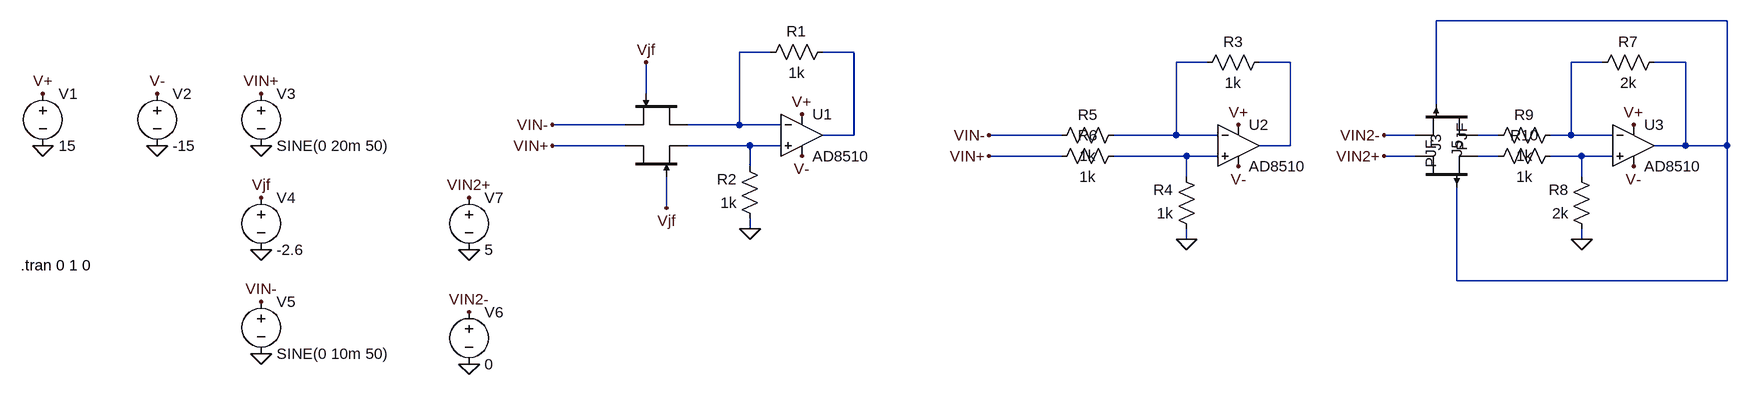
[diagram p0: schematic jfet_gain.asc]
jfet_gain.asc, the LTspice schematic file:
Version 4
SHEET 1 2616 680
WIRE 2608 -160 2160 -160
WIRE 1136 -112 1088 -112
WIRE 1264 -112 1216 -112
WIRE 1808 -96 1760 -96
WIRE 1936 -96 1888 -96
WIRE 2416 -96 2368 -96
WIRE 2544 -96 2496 -96
WIRE 944 -48 944 -96
WIRE 2160 -32 2160 -160
WIRE 912 0 800 0
WIRE 1088 0 1088 -112
WIRE 1088 0 1008 0
WIRE 1152 0 1088 0
WIRE 1264 16 1264 -112
WIRE 1264 16 1216 16
WIRE 1584 16 1472 16
WIRE 1760 16 1760 -96
WIRE 1760 16 1664 16
WIRE 1824 16 1760 16
WIRE 2128 16 2080 16
WIRE 2256 16 2224 16
WIRE 2368 16 2368 -96
WIRE 2368 16 2336 16
WIRE 2432 16 2368 16
WIRE 912 32 800 32
WIRE 1104 32 1008 32
WIRE 1152 32 1104 32
WIRE 1936 32 1936 -96
WIRE 1936 32 1888 32
WIRE 2544 32 2544 -96
WIRE 2544 32 2496 32
WIRE 2608 32 2608 -160
WIRE 2608 32 2544 32
WIRE 1584 48 1472 48
WIRE 1776 48 1664 48
WIRE 1824 48 1776 48
WIRE 2128 48 2080 48
WIRE 2256 48 2224 48
WIRE 2384 48 2336 48
WIRE 2432 48 2384 48
WIRE 1104 64 1104 32
WIRE 1776 80 1776 48
WIRE 2384 80 2384 48
WIRE 976 128 976 80
WIRE 1104 160 1104 144
WIRE 1776 176 1776 160
WIRE 2384 176 2384 160
WIRE 2192 240 2192 96
WIRE 2608 240 2608 32
WIRE 2608 240 2192 240
FLAG 16 32 0
FLAG 192 32 0
FLAG 352 32 0
FLAG 16 -48 V+
FLAG 192 -48 V-
FLAG 352 -48 VIN+
FLAG 800 32 VIN+
FLAG 1184 48 V-
FLAG 1184 -16 V+
FLAG 352 192 0
FLAG 352 112 Vjf
FLAG 944 -96 Vjf
FLAG 352 352 0
FLAG 352 272 VIN-
FLAG 800 0 VIN-
FLAG 976 128 Vjf
FLAG 1104 160 0
FLAG 1472 48 VIN+
FLAG 1856 64 V-
FLAG 1856 0 V+
FLAG 1472 16 VIN-
FLAG 1776 176 0
FLAG 2080 48 VIN2+
FLAG 2464 64 V-
FLAG 2464 0 V+
FLAG 2080 16 VIN2-
FLAG 2384 176 0
FLAG 672 368 0
FLAG 672 288 VIN2-
FLAG 672 192 0
FLAG 672 112 VIN2+
SYMBOL voltage 16 -64 R0
WINDOW 123 0 0 Left 0
WINDOW 39 0 0 Left 0
SYMATTR InstName V1
SYMATTR Value 15
SYMBOL voltage 192 -64 R0
WINDOW 123 0 0 Left 0
WINDOW 39 0 0 Left 0
SYMATTR InstName V2
SYMATTR Value -15
SYMBOL voltage 352 -64 R0
WINDOW 123 0 0 Left 0
WINDOW 39 0 0 Left 0
SYMATTR InstName V3
SYMATTR Value SINE(0 20m 50)
SYMBOL OpAmps\\AD8510 1184 -48 R0
SYMATTR InstName U1
SYMBOL voltage 352 96 R0
WINDOW 123 0 0 Left 0
WINDOW 39 0 0 Left 0
SYMATTR InstName V4
SYMATTR Value -2.6
SYMBOL res 1232 -128 R90
WINDOW 0 0 56 VBottom 2
WINDOW 3 32 56 VTop 2
SYMATTR InstName R1
SYMATTR Value 1k
SYMBOL njf 1008 -48 R90
WINDOW 0 56 32 Invisible 2
WINDOW 3 56 72 Invisible 2
SYMATTR InstName J2
SYMATTR Value 2N3819
SYMBOL voltage 352 256 R0
WINDOW 123 0 0 Left 0
WINDOW 39 0 0 Left 0
SYMATTR InstName V5
SYMATTR Value SINE(0 10m 50)
SYMBOL njf 912 80 R270
WINDOW 0 56 32 Invisible 2
WINDOW 3 56 72 Invisible 2
SYMATTR InstName J1
SYMATTR Value 2N3819
SYMBOL res 1120 160 R180
WINDOW 0 36 76 Left 2
WINDOW 3 36 40 Left 2
SYMATTR InstName R2
SYMATTR Value 1k
SYMBOL OpAmps\\AD8510 1856 -32 R0
SYMATTR InstName U2
SYMBOL res 1904 -112 R90
WINDOW 0 0 56 VBottom 2
WINDOW 3 32 56 VTop 2
SYMATTR InstName R3
SYMATTR Value 1k
SYMBOL res 1792 176 R180
WINDOW 0 36 76 Left 2
WINDOW 3 36 40 Left 2
SYMATTR InstName R4
SYMATTR Value 1k
SYMBOL res 1680 0 R90
WINDOW 0 0 56 VBottom 2
WINDOW 3 32 56 VTop 2
SYMATTR InstName R5
SYMATTR Value 1k
SYMBOL res 1680 32 R90
WINDOW 0 0 56 VBottom 2
WINDOW 3 32 56 VTop 2
SYMATTR InstName R6
SYMATTR Value 1k
SYMBOL OpAmps\\AD8510 2464 -32 R0
SYMATTR InstName U3
SYMBOL res 2512 -112 R90
WINDOW 0 0 56 VBottom 2
WINDOW 3 32 56 VTop 2
SYMATTR InstName R7
SYMATTR Value 2k
SYMBOL res 2400 176 R180
WINDOW 0 36 76 Left 2
WINDOW 3 36 40 Left 2
SYMATTR InstName R8
SYMATTR Value 2k
SYMBOL res 2352 0 R90
WINDOW 0 0 56 VBottom 2
WINDOW 3 32 56 VTop 2
SYMATTR InstName R9
SYMATTR Value 1k
SYMBOL res 2352 32 R90
WINDOW 0 0 56 VBottom 2
WINDOW 3 32 56 VTop 2
SYMATTR InstName R10
SYMATTR Value 1k
SYMBOL pjf 2224 -32 R90
SYMATTR InstName J5
SYMBOL pjf 2128 96 R270
SYMATTR InstName J3
SYMBOL voltage 672 272 R0
WINDOW 123 0 0 Left 0
WINDOW 39 0 0 Left 0
SYMATTR InstName V6
SYMATTR Value 0
SYMBOL voltage 672 96 R0
WINDOW 123 0 0 Left 0
WINDOW 39 0 0 Left 0
SYMATTR InstName V7
SYMATTR Value 5
TEXT -18 216 Left 2 !.tran 0 1 0

The netlist it stands for:
* jfet_gain.asc
V1 V+ 0 15
V2 V- 0 -15
V3 VIN+ 0 SINE(0 20m 50)
XU1 N008 N002 V+ V- N003 AD8510  ; pins In+ In- V+ V- OUT
V4 Vjf 0 -2.6
R1 N003 N002 1k
J2 N002 Vjf VIN- 2N3819
V5 VIN- 0 SINE(0 10m 50)
J1 VIN+ Vjf N008 2N3819
R2 0 N008 1k
XU2 N009 N004 V+ V- N005 AD8510  ; pins In+ In- V+ V- OUT
R3 N005 N004 1k
R4 0 N009 1k
R5 N004 VIN- 1k
R6 N009 VIN+ 1k
XU3 N011 N006 V+ V- N001 AD8510  ; pins In+ In- V+ V- OUT
R7 N001 N006 2k
R8 0 N011 2k
R9 N006 N007 1k
R10 N011 N010 1k
J5 N007 N001 VIN2- PJF
J3 VIN2+ N001 N010 PJF
V6 VIN2- 0 0
V7 VIN2+ 0 5
.model NJF NJF
.model PJF PJF
.lib standard.jft
.tran 0 1 0
.backanno
.end